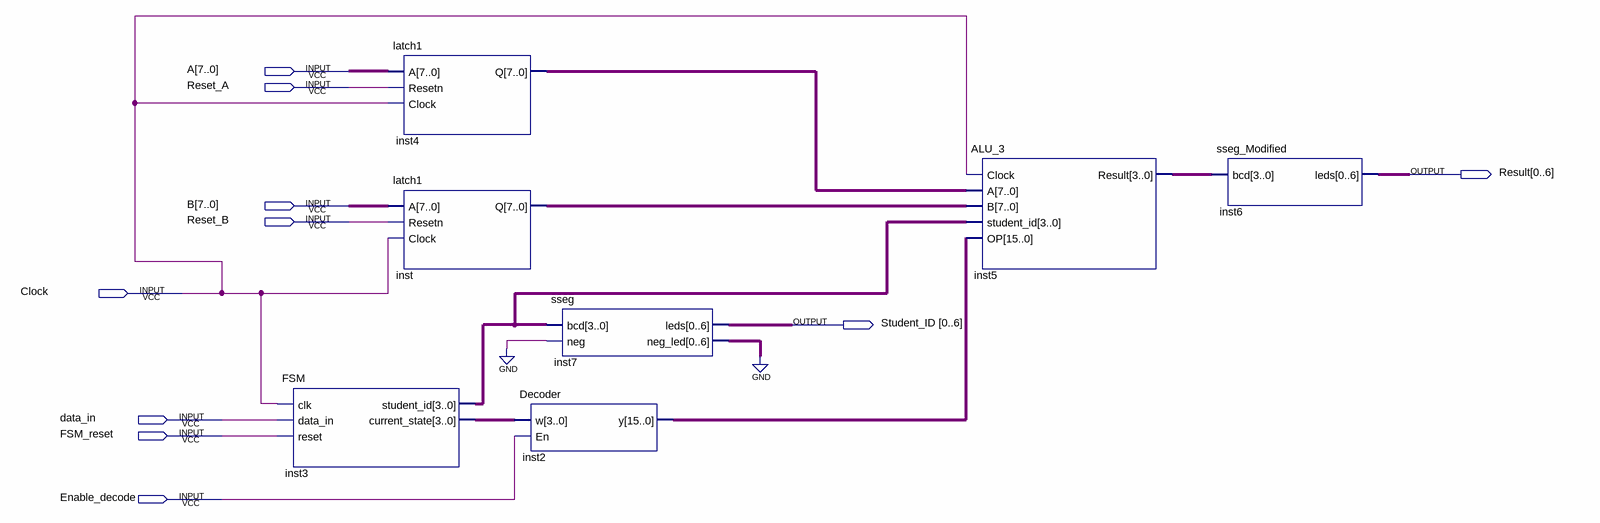
[diagram p0: schematic sheet]
// Quartus schematic Problem_3.bdf as structural Verilog: 7 symbols, 10 pins
module Problem_3 (
  input  [7:0] A,
  input  Reset_A,
  input  [7:0] B,
  input  Reset_B,
  input  Clock,
  input  data_in,
  input  FSM_reset,
  input  Enable_decode,
  output [0:6] Result,
  output [0:6] Student_ID
);

  wire [3:0] inst3_current_state, inst3_student_id, inst5_result;
  wire [6:0] inst7_neg_led;
  wire [7:0] inst4_q, inst_q;
  wire [15:0] inst2_y;

  FSM inst3 (
    .clk(Clock), .data_in(data_in), .reset(FSM_reset), .student_id(inst3_student_id),
    .current_state(inst3_current_state));
  latch1 inst4 (.A(A), .Resetn(Reset_A), .Clock(Clock), .Q(inst4_q));
  latch1 inst (.A(B), .Resetn(Reset_B), .Clock(Clock), .Q(inst_q));
  sseg inst7 (.bcd(inst3_student_id), .neg(1'b0), .leds(Student_ID), .neg_led(inst7_neg_led));
  Decoder inst2 (.w(inst3_current_state), .En(Enable_decode), .y(inst2_y));
  ALU_3 inst5 (
    .Clock(Clock), .A(inst4_q), .B(inst_q), .student_id(inst3_student_id), .OP(inst2_y), .Result(inst5_result));
  sseg_Modified inst6 (.bcd(inst5_result), .leds(Result));
  // also tied to GND on the sheet: {inst7_neg_led[0], inst7_neg_led[1], inst7_neg_led[2], inst7_neg_led[3], inst7_neg_led[4], inst7_neg_led[5], inst7_neg_led[6]}
endmodule
